# Altium schematic sheet 2.4FEM.SchDoc
size A4
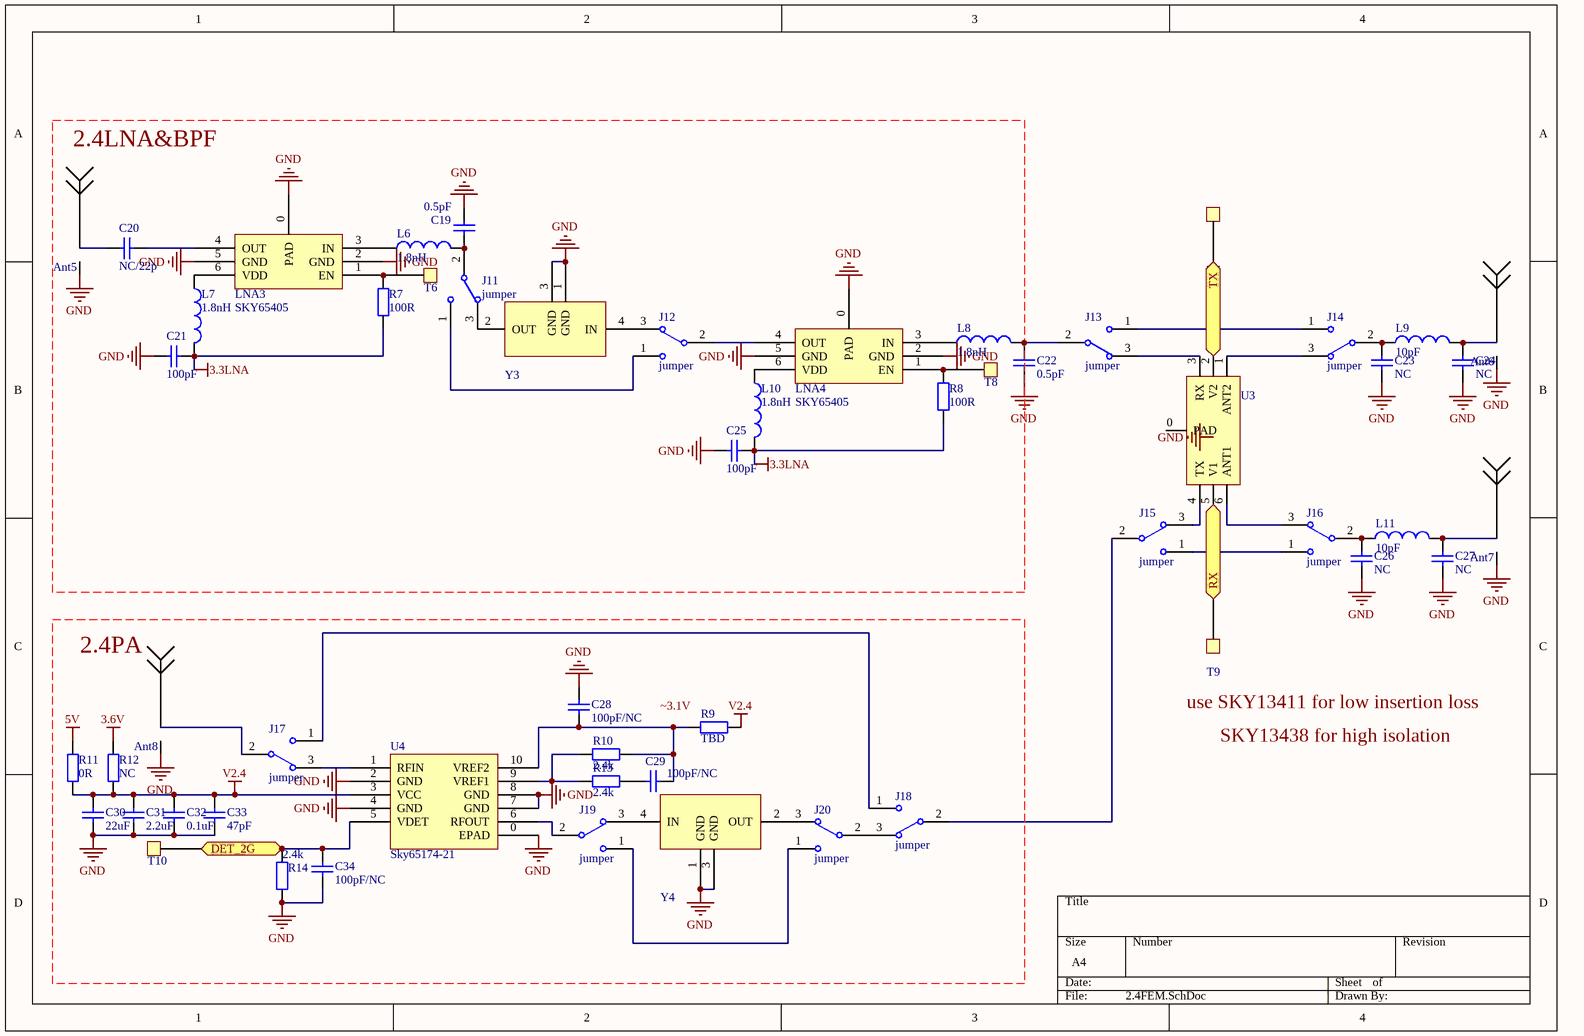
[diagram p0: 2.4FEM.SchDoc]

## Parts
Ant5  Antenna  [SMA-2]  (value not drawn)
Ant6  Antenna  [SMA-2]  (value not drawn)
Ant7  Antenna  [SMA-2]  (value not drawn)
Ant8  Antenna  [SMA-2]  (value not drawn)
C19  value 0.5pF  [0402]  (hidden comment: Cap)
C20  NC/22p  [0402]
C21  value 100pF  [0402]  (hidden comment: Cap)
C22  value 0.5pF  [0402]  (hidden comment: Cap)
C23  value NC  [0402]  (hidden comment: Cap)
C24  value NC  [0402]  (hidden comment: Cap)
C25  value 100pF  [0402]  (hidden comment: Cap)
C26  value NC  [0402]  (hidden comment: Cap)
C27  value NC  [0402]  (hidden comment: Cap)
C28  value 100pF/NC  [0402]  (hidden comment: Cap)
C29  value 100pF/NC  [0402]  (hidden comment: Cap)
C30  value 22uF  [0805]  (hidden comment: Cap)
C31  value 2.2uF  [0603]  (hidden comment: Cap)
C32  value 0.1uF  [0402]  (hidden comment: Cap)
C33  value 47pF  [0402]  (hidden comment: Cap)
C34  value 100pF/NC  [0402]  (hidden comment: Cap)
J11  jumper  [0402J]
J12  jumper  [0402J]
J13  jumper  [0402J]
J14  jumper  [0402J]
J15  jumper  [0402J]
J16  jumper  [0402J]
J17  jumper  [0402J]
J18  jumper  [0402J]
J19  jumper  [0402J]
J20  jumper  [0402J]
L6  value 1.8nH  [0402]  (hidden comment: Inductor)
L7  value 1.8nH  [0402]  (hidden comment: Inductor)
L8  value 1.8nH  [0402]  (hidden comment: Inductor)
L9  value 10pF  [0402]  (hidden comment: Inductor)
L10  value 1.8nH  [0402]  (hidden comment: Inductor)
L11  value 10pF  [0402]  (hidden comment: Inductor)
LNA3  SKY65405  [SKY65404-31]
LNA4  SKY65405  [SKY65404-31]
R7  value 100R  [0402]  (hidden comment: Res2)
R8  value 100R  [0402]  (hidden comment: Res2)
R9  value TBD  [0603]  (hidden comment: Res2)
R10  value 2.4k  [0402]  (hidden comment: Res2)
R11  value 0R  [0603]  (hidden comment: Res2)
R12  value NC  [0603]  (hidden comment: Res2)
R13  value 2.4k  [0402]  (hidden comment: Res2)
R14  value 2.4k  [0402]  (hidden comment: Res2)
T6  TestPad  [TestPad - 1mm]  (value not drawn)
T7  TestPad  [TestPad - 1mm]  (value not drawn)
T8  TestPad  [TestPad - 1mm]  (value not drawn)
T9  TestPad  [TestPad - 1mm]  (value not drawn)
T10  TestPad  [TestPad - 1mm]  (value not drawn)
U3  SKY13411  [SKY65404-31]  (value not drawn)
U4  Sky65174-21  [SKY65174-21]
Y3  2450BP39C100A  [2450BP39C100A]  (value not drawn)
Y4  2450BP39C100A  [2450BP39C100A]  (value not drawn)

## Ports
DET_2G, RX, TX

## Nets
3.3LNA: C21.2 C25.2 L7.2 L10.2 R7.2 R8.2
3.6V: R12.1
5V: R11.1
GND: Ant5.GND(G) Ant6.GND(G) Ant7.GND(G) Ant8.GND(G) C19.1 C21.1 C22.1 C23.1 C24.1 C25.1 C26.1 C27.1 C28.1 C30.2 C31.2 C32.2 C33.2 C34.2 LNA3.0(PAD) LNA3.2(GND) LNA3.5(GND) LNA4.0(PAD) LNA4.2(GND) LNA4.5(GND) R14.1 U4.0(EPAD) U4.2(GND) U4.4(GND) U4.7(GND) U4.8(GND) Y3.1(GND) Y3.3(GND) Y4.1(GND) Y4.3(GND)
V2.4: C30.1 C31.1 C32.1 C33.1 R9.1 R11.2 R12.2 U4.3(VCC)
DET_2G: C34.1 R14.2 T10.1 U4.5(VDET) ; port DET_2G
RX: T9.1 U3.5(V1) ; port RX
TX: T7.1 U3.2(V2) ; port TX
NetAnt5_1: Ant5.1 C20.1
NetAnt6_1: Ant6.1 C24.2 L9.2
NetAnt7_1: Ant7.1 C27.2 L11.2
NetAnt8_1: Ant8.1 J17.2
NetC19_2: C19.2 J11.2 L6.2
NetC20_2: C20.2 LNA3.4(OUT)
NetC22_2: C22.2 J13.2 L8.2
NetC23_2: C23.2 J14.2 L9.1
NetC26_2: C26.2 J16.2 L11.1
NetC28_2: C28.2 C29.2 R9.2 R10.1 U4.10(VREF2)
NetC29_1: C29.1 R13.1
NetJ11_1: J11.1 J12.1
NetJ11_3: J11.3 Y3.2(OUT)
NetJ12_2: J12.2 LNA4.4(OUT)
NetJ12_3: J12.3 Y3.4(IN)
NetJ13_1: J13.1 J14.1
NetJ13_3: J13.3 U3.3(RX)
NetJ14_3: J14.3 U3.1(ANT2)
NetJ15_1: J15.1 J16.1
NetJ15_2: J15.2 J18.2
NetJ15_3: J15.3 U3.4(TX)
NetJ16_3: J16.3 U3.6(ANT1)
NetJ17_1: J17.1 J18.1
NetJ17_3: J17.3 U4.1(RFIN)
NetJ18_3: J18.3 J20.2
NetJ19_1: J19.1 J20.1
NetJ19_2: J19.2 U4.6(RFOUT)
NetJ19_3: J19.3 Y4.4(IN)
NetJ20_3: J20.3 Y4.2(OUT)
NetL6_1: L6.1 LNA3.3(IN)
NetL7_1: L7.1 LNA3.6(VDD)
NetL8_1: L8.1 LNA4.3(IN)
NetL10_1: L10.1 LNA4.6(VDD)
NetLNA3_1: LNA3.1(EN) R7.1 T6.1
NetLNA4_1: LNA4.1(EN) R8.1 T8.1
NetR10_2: R10.2 R13.2 U4.9(VREF1)

Not connected (* = marked no-connect by the designer): U3 0(PAD)

## Notes on the sheet
- 2.4LNA&BPF
- (near Ant8) 2.4PA
- (near T9) use SKY13411 for low insertion loss
- SKY13438 for high isolation
- Labels drawn without touching a wire or pin: GND, ~3.1V

## Library data of the parts
C19-C34 = Cap: Capacitor; Published: 8-Jun-2000; LatestRevisionDate: 17-Jul-2002; LatestRevisionNote: Re-released for DXP Platform.; PackageReference: RAD-0.3; Publisher: Altium Limited; PackageDescription: Radial Cap, Thru-Hole; 2 Leads; 0.3 in Pin Spacing
J11-J20 = SW-SPDT: SPDT Subminiature Toggle Switch, Right Angle Mounting, Vertical Actuation; Published: 24-Mar-1999; LatestRevisionDate: 17-Dec-2003; LatestRevisionNote: Schematic revised, PCB Footprint replaced.; DatasheetVersion: 05-Dec-2000; PackageReference: TL36WW15050; Publisher: Altium Limited; PackageDescription: Switch; 4 Leads; ComponentLink1Description: Manufacturer Link; ComponentLink1URL: http://www.apem.com
L6-L11 = Inductor: Code_IEC: 1005; Published: 8-Jun-2000; LatestRevisionDate: 29-May-2009; LatestRevisionNote: IPC-7351 Footprint Added.; PackageReference: 0402-A; Publisher: Altium Limited; PackageDescription: Chip Inductor; Code_JEITA: 0402
LNA3 LNA4 = SKY65404-31
R7-R14 = Res2: Resistor; Published: 8-Jun-2000; LatestRevisionDate: 17-Jul-2002; LatestRevisionNote: Re-released for DXP Platform.; PackageReference: AXIAL-0.4; Publisher: Altium Limited; PackageDescription: Axial Device, Thru-Hole; 2 Leads; 0.4 in Pin Spacing